# Altium schematic sheet [02] LED.SchDoc: RGB Ring LED
size B; DocumentNumber: 2; SheetNumber: 2; SheetTotal: 3; PageSize: B; Designators: 1-99
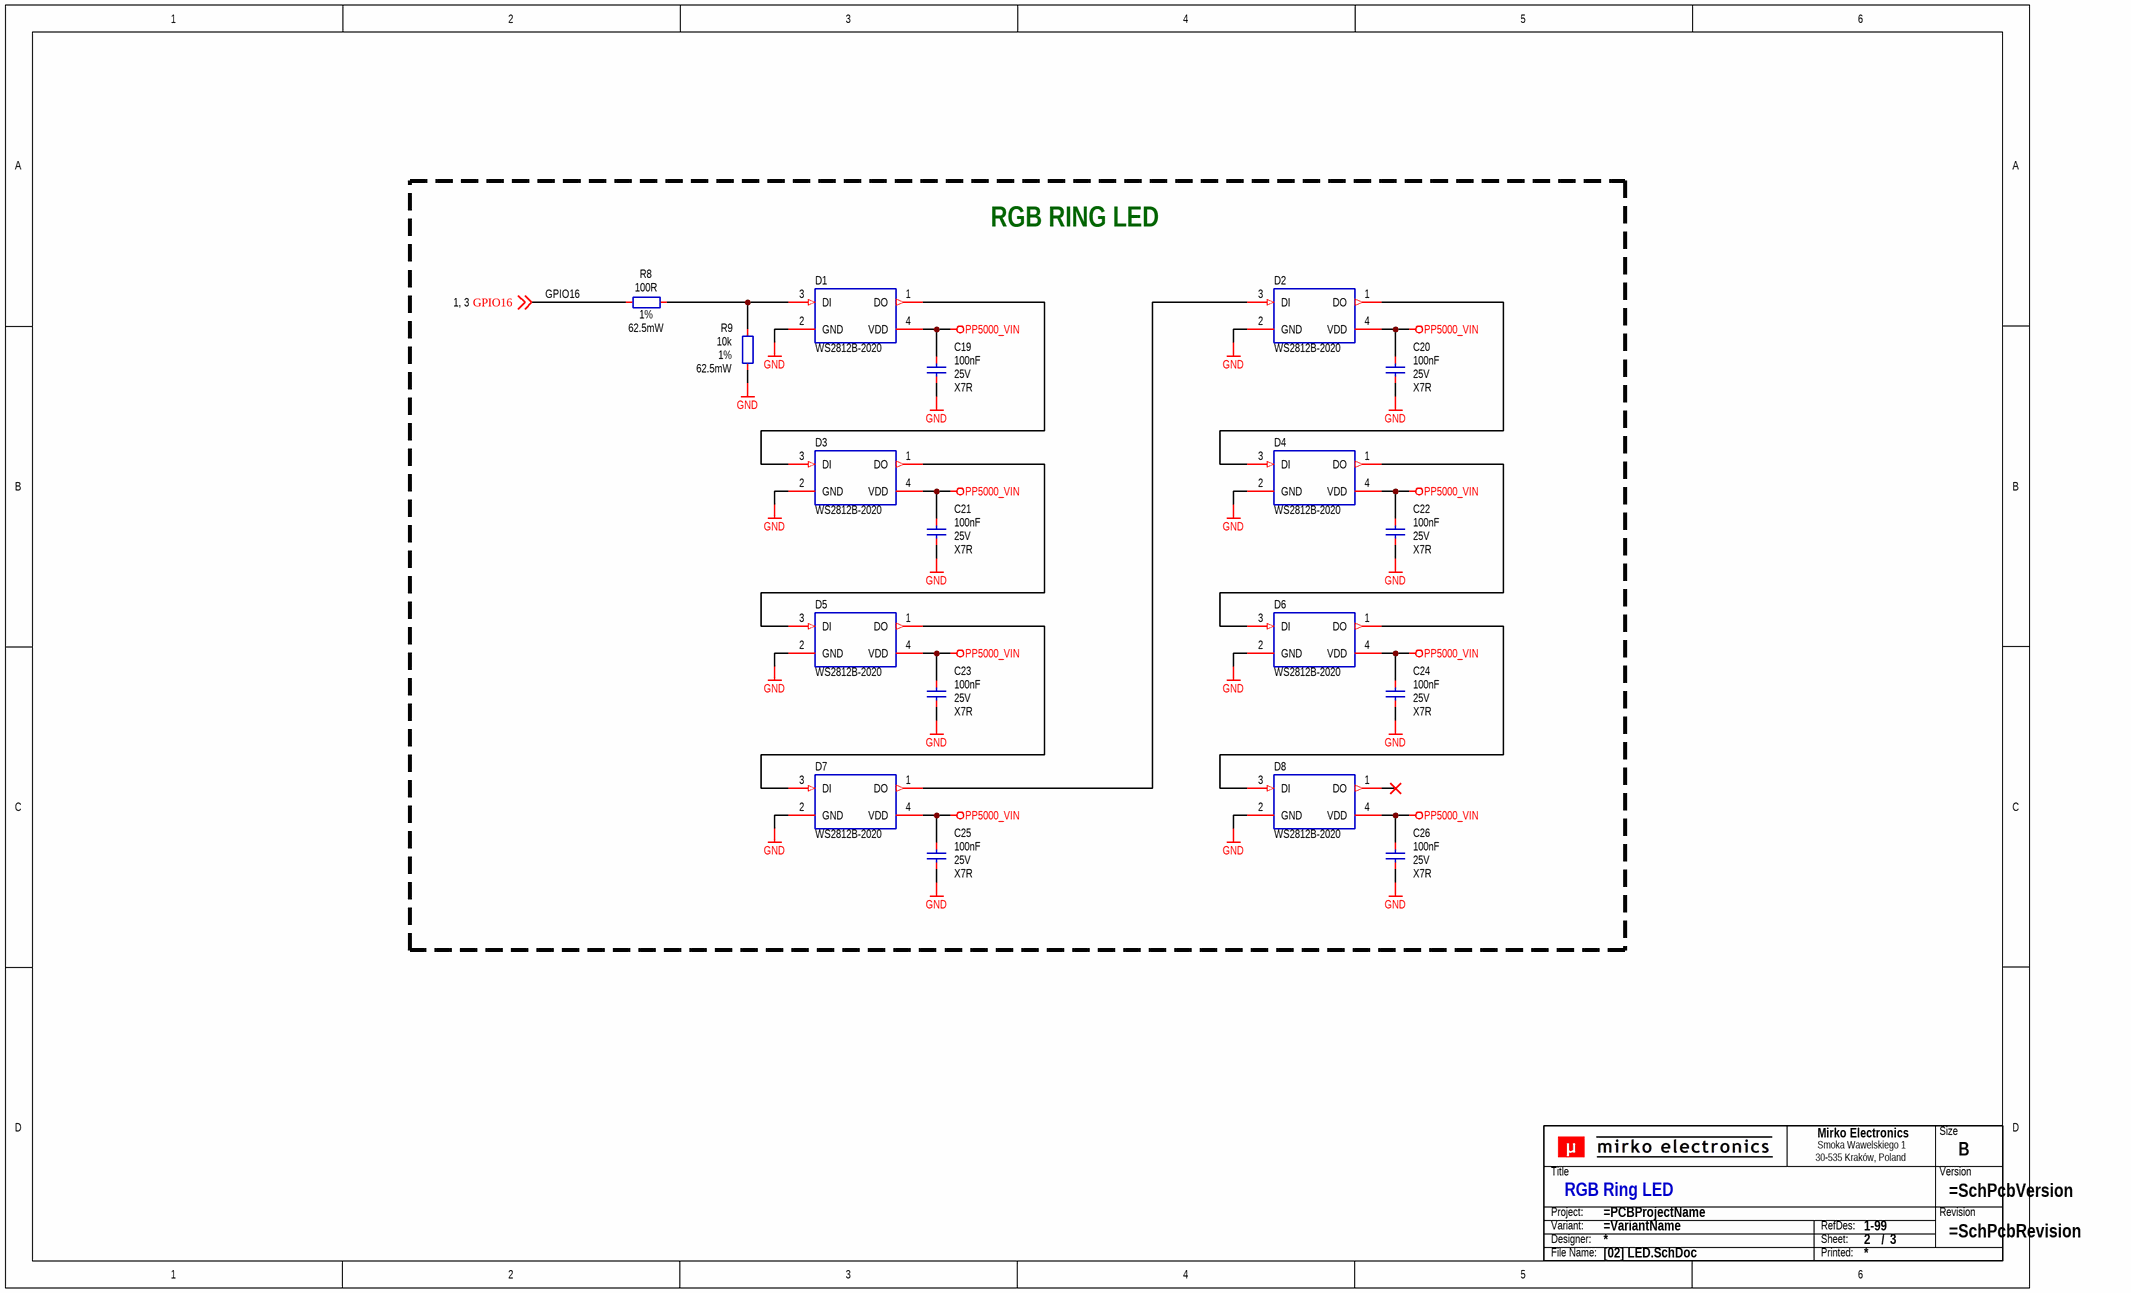
[diagram p0: [02] LED.SchDoc]

## Parts
C19  100nF  Voltage Rating: 25V  Dielectric: X7R  [CAP_0402_R]
C20  100nF  Voltage Rating: 25V  Dielectric: X7R  [CAP_0402_R]
C21  100nF  Voltage Rating: 25V  Dielectric: X7R  [CAP_0402_R]
C22  100nF  Voltage Rating: 25V  Dielectric: X7R  [CAP_0402_R]
C23  100nF  Voltage Rating: 25V  Dielectric: X7R  [CAP_0402_R]
C24  100nF  Voltage Rating: 25V  Dielectric: X7R  [CAP_0402_R]
C25  100nF  Voltage Rating: 25V  Dielectric: X7R  [CAP_0402_R]
C26  100nF  Voltage Rating: 25V  Dielectric: X7R  [CAP_0402_R]
D1  WS2812B-2020  [LED_WRD_WS2812X-2020]
D2  WS2812B-2020  [LED_WRD_WS2812X-2020]
D3  WS2812B-2020  [LED_WRD_WS2812X-2020]
D4  WS2812B-2020  [LED_WRD_WS2812X-2020]
D5  WS2812B-2020  [LED_WRD_WS2812X-2020]
D6  WS2812B-2020  [LED_WRD_WS2812X-2020]
D7  WS2812B-2020  [LED_WRD_WS2812X-2020]
D8  WS2812B-2020  [LED_WRD_WS2812X-2020]
R8  100R  Tolerance: 1%  Power Rating: 62.5mW  [RES_0402_R]
R9  10k  Tolerance: 1%  Power Rating: 62.5mW  [RES_0402_R]
TB?  Title block  (value not drawn)  (graphical)

## Blocks framed on the sheet
RGB RING LED: C19-C26 D1-D8 R8 R9

## Nets
GND: C19.1 C20.1 C21.1 C22.1 C23.1 C24.1 C25.1 C26.1 D1.2(GND) D2.2(GND) D3.2(GND) D4.2(GND) D5.2(GND) D6.2(GND) D7.2(GND) D8.2(GND) R9.1
PP5000_VIN: C19.2 C20.2 C21.2 C22.2 C23.2 C24.2 C25.2 C26.2 D1.4(VDD) D2.4(VDD) D3.4(VDD) D4.4(VDD) D5.4(VDD) D6.4(VDD) D7.4(VDD) D8.4(VDD)
GPIO16: R8.2 ; off-sheet GPIO16
NetD1_1: D1.1(DO) D3.3(DI)
NetD1_3: D1.3(DI) R8.1 R9.2
NetD2_1: D2.1(DO) D4.3(DI)
NetD2_3: D2.3(DI) D7.1(DO)
NetD3_1: D3.1(DO) D5.3(DI)
NetD4_1: D4.1(DO) D6.3(DI)
NetD5_1: D5.1(DO) D7.3(DI)
NetD6_1: D6.1(DO) D8.3(DI)

Not connected (* = marked no-connect by the designer): D8 1(DO)*

## Notes on the sheet
- (in symbol SCH_TITLE_BLOCK_V1) Mirko Electronics; Size; Smoka Wawelskiego 1; 30-535 Kraków, Poland; Title; Version; Project:; Revision; Variant:; RefDes:; Designer:; Sheet:; /; File Name:; Printed:

## Library data of the parts
C19-C26 = CAP-0026: Capacitor; MLCC; GENERIC; TBD; TBD; TBD; TBD; SMD; 0402 (1005);; Manufacturer: Samsung Electro-Mechanics; MPN: CL05B104KA5NNNC; Component Body: 1.00 x 0.50mm; ID: CAP-0026; Component Type: Capacitor; Component Subtype: MLCC; Value: 100nF; Mounting Type: SMD; Package (Case): 0402 (1005); Component Height: TBD; Packaging Type: TBD; ROHS Status: TBD; Operating Temperature: TBD; Capacitance: 100nF; Tolerance: TBD; Features: TBD; Supplier 1: LCSC; Supplier 2: Farnell; Supplier Part Number 1: C155422; Supplier Part Number 2: 2496772; Supplier 3: Mouser; Supplier Part Number 3: 187-CL05B104KA5NNNC
D1-D8 = LED_WRD_WS2812B-2020: LED; RGB; Manufacturer: Worldsemi; Specification: Digital LED RGB diode, 12mA, 800kbps, SMD 2020 package; Cross Refference: NO; Component Type: LED Diode; Mounting Type: SMD; MPN: WS2812B-2020; Operating Temperature: -25°C to +85°C; Package (Case): SMD 2020; Value: WS2812B-2020; Supplier 1: LCSC; Supplier Part Number 1: C965555; Supplier 2: Farnell; Supplier 3: Mouser; Supplier Part Number 3: 485-4684 (10-pack)
R8 = RES-0002: Resistor; Thick Film; 100R; 1%; 62.5mW; 100PPM; 50V; Standard; SMD; 0402 (1005);; Manufacturer: Yageo Corporation; MPN: RC0402FR-07100RL; Component Body: 1.00 x 0.50mm; Packaging Type: Tape & Reel; ID: RES-0002; Component Type: Resistor; Component Subtype: Thick Film; Value: 100R; Mounting Type: SMD; Package (Case): 0402 (1005); Component Height: 0.35mm; ROHS Status: RoHS Compliant; Operating Temperature: -55°C to +155°C; Resistance: 100R; TCR: 100PPM; Voltage Rating: 50V; Features: Standard; Supplier 1: LCSC; Supplier 2: Farnell; Supplier Part Number 1: C106232; Supplier Part Number 2: 2421888; Supplier 3: Mouser; Supplier Part Number 3: 603-RC0402FR-07100RL
R9 = RES-0004: Resistor; Thick Film; 10k; 1%; 62.5mW; 100PPM; 50V; Standard; SMD; 0402 (1005);; Manufacturer: Yageo Corporation; MPN: RC0402FR-0710KL; Component Body: 1.00 x 0.50mm; Packaging Type: Tape & Reel; ID: RES-0004; Component Type: Resistor; Component Subtype: Thick Film; Value: 10k; Mounting Type: SMD; Package (Case): 0402 (1005); Component Height: 0.35mm; ROHS Status: RoHS Compliant; Operating Temperature: -55°C to +155°C; Resistance: 10k; TCR: 100PPM; Voltage Rating: 50V; Features: Standard; Supplier 1: LCSC; Supplier 2: Farnell; Supplier Part Number 1: C60490; Supplier Part Number 2: 9239359; Supplier 3: Mouser; Supplier Part Number 3: 603-RC0402FR-0710KL
TB? = SCH_TITLE_BLOCK_V1: Component Type: Title block; Manufacturer: -; Mounting Type: Non component; MPN: -; Operating Temperature: -; Package: -; Specification: Title block; Value: Title block; Replacement: -; System: ?